# EAGLE design Bonus (EAGLE 9.2.2)

## Sheet 1 of 2
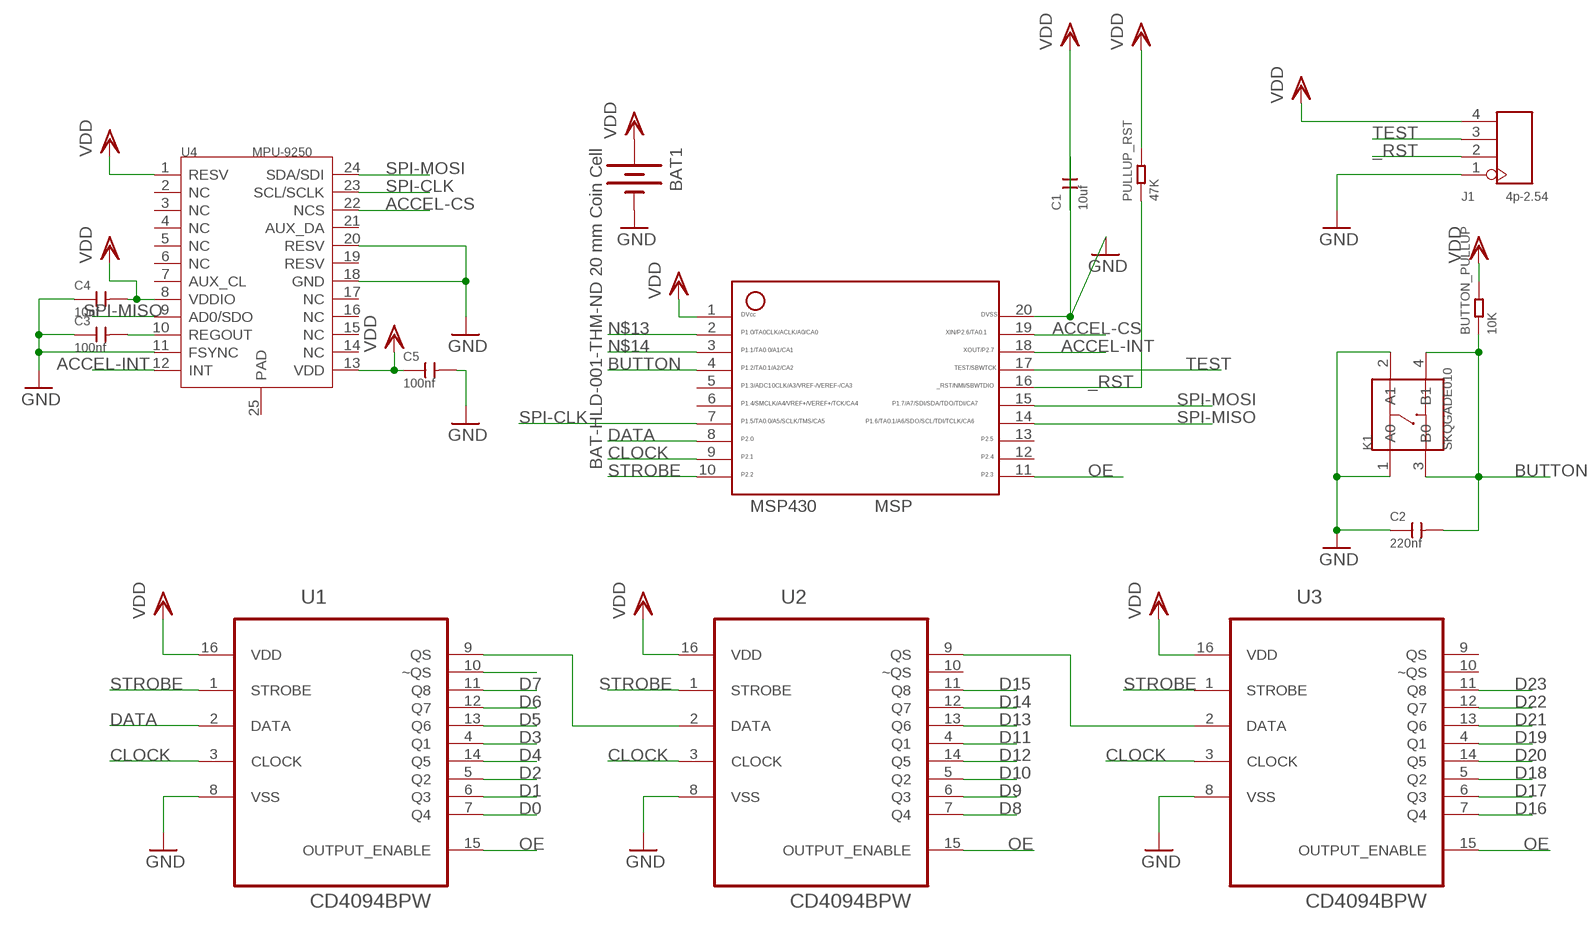
[diagram p0: schematic, sheet 1]

### Parts
BAT1  BAT-HLD-001-THM-ND 20 mm Coin Cell  BATTERYFOB  [BATTCON_20MM_PTH_COMPACT]
BUTTON_PULLUP  10K  SMD-RES-10K-1%-1/10W(0603)  [R0603]
C1  10uf  CERAMIC-10UF-10V-(-20%～+80%)-Y5V(0805)  [C0805]
C2  220nf  CERAMIC-220NF-25V-10%-X7R(0603)  [C0603]
C3  100nf  CERAMIC-100NF-25V-10%-X7R(0402)  [C0402]
C4  10nf  CERAMIC-10NF-50V-10%-X7R(0402)  [C0402]
C5  100nf  CERAMIC-100NF-25V-10%-X7R(0402)  [C0402]
J1  4p-2.54  DIP-BLACK-FEMALE-HEADER-VERT(4P-2.54)  [H4-2.54]
K1  SKQGADE010  SMD-BUTTON(4P-5.2X5.2X1.5MM-SKQGADE010)-SKQGADE010  [SW4-SMD-5.2X5.2X1.5MM]
MSP430  MSP  MSP430  [20_PIN]
PULLUP_RST  47K  SMD-RES-47K-5%-1/10W(0603)  [R0603]
U1  CD4094BPW  [SOP65P640X120-16N]
U2  CD4094BPW  [SOP65P640X120-16N]
U3  CD4094BPW  [SOP65P640X120-16N]
U4  MPU-9250  MOTION/POSITION-MPU-9250(QFN24)  [QFN24G-0.4-3X3MM]

### Nets
_RST: J1.2 MSP430.16 PULLUP_RST.1
ACCEL-CS: MSP430.19 U4.22(NCS)
ACCEL-INT: MSP430.18 U4.12(INT)
BUTTON: BUTTON_PULLUP.1 C2.2 K1.3(B0) K1.4(B1) MSP430.4
CLOCK: MSP430.9 U1.3(CLOCK) U2.3(CLOCK) U3.3(CLOCK)
D0: U1.7(Q4) ; also sheet 2
D1: U1.6(Q3) ; also sheet 2
D2: U1.5(Q2) ; also sheet 2
D3: U1.4(Q1) ; also sheet 2
D4: U1.14(Q5) ; also sheet 2
D5: U1.13(Q6) ; also sheet 2
D6: U1.12(Q7) ; also sheet 2
D7: U1.11(Q8) ; also sheet 2
D8: U2.7(Q4) ; also sheet 2
D9: U2.6(Q3) ; also sheet 2
D10: U2.5(Q2) ; also sheet 2
D11: U2.4(Q1) ; also sheet 2
D12: U2.14(Q5) ; also sheet 2
D13: U2.13(Q6) ; also sheet 2
D14: U2.12(Q7) ; also sheet 2
D15: U2.11(Q8) ; also sheet 2
D16: U3.7(Q4) ; also sheet 2
D17: U3.6(Q3) ; also sheet 2
D18: U3.5(Q2) ; also sheet 2
D19: U3.4(Q1) ; also sheet 2
D20: U3.14(Q5) ; also sheet 2
D21: U3.13(Q6) ; also sheet 2
D22: U3.12(Q7) ; also sheet 2
D23: U3.11(Q8) ; also sheet 2
DATA: MSP430.8 U1.2(DATA)
GND: BAT1.2(-) C1.2 C2.1 C3.1 C4.1 C5.2 J1.1 K1.1(A0) K1.2(A1) MSP430.20 U1.8(VSS) U2.8(VSS) U3.8(VSS) U4.11(FSYNC) U4.18(GND) U4.20(RESV) ; also sheet 2
N$7: U2.9(QS) U3.2(DATA)
N$8: U1.9(QS) U2.2(DATA)
N$11: U1.10(~QS)
N$12: C3.2 U4.10(REGOUT)
N$13: MSP430.2
N$14: MSP430.3
OE: MSP430.11 U1.15(OUTPUT_ENABLE) U2.15(OUTPUT_ENABLE) U3.15(OUTPUT_ENABLE)
SPI-CLK: MSP430.7 U4.23(SCL/SCLK)
SPI-MISO: MSP430.14 U4.9(AD0/SDO)
SPI-MOSI: MSP430.15 U4.24(SDA/SDI)
STROBE: MSP430.10 U1.1(STROBE) U2.1(STROBE) U3.1(STROBE)
TEST: J1.3 MSP430.17
VDD: BAT1.1(+) BAT1.3(+) BAT1.4(+) BAT1.5(+) BUTTON_PULLUP.2 C1.1 C4.2 C5.1 J1.4 MSP430.1 PULLUP_RST.2 U1.16(VDD) U2.16(VDD) U3.16(VDD) U4.1(RESV) U4.8(VDDIO) U4.13(VDD)
Unconnected: MSP430.5 MSP430.6 MSP430.12 MSP430.13 U2.10(~QS) U3.9(QS) U3.10(~QS) U4.2(NC) U4.3(NC) U4.4(NC) U4.5(NC) U4.6(NC) U4.7(AUX_CL) U4.14(NC) U4.15(NC) U4.16(NC) U4.17(NC) U4.19(RESV) U4.21(AUX_DA) U4.25(PAD)

## Sheet 2 of 2
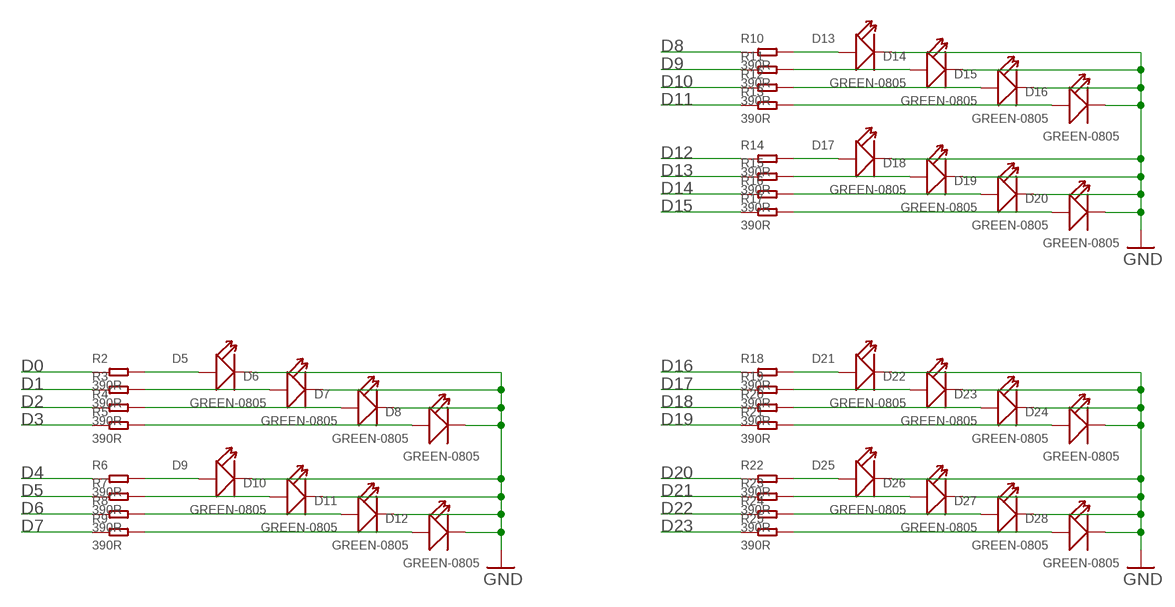
[diagram p1: schematic, sheet 2]

### Parts
D5  GREEN-0805  SMD-LED-CLEAR-GREEN(0805)  [LED-0805]
D6  GREEN-0805  SMD-LED-CLEAR-GREEN(0805)  [LED-0805]
D7  GREEN-0805  SMD-LED-CLEAR-GREEN(0805)  [LED-0805]
D8  GREEN-0805  SMD-LED-CLEAR-GREEN(0805)  [LED-0805]
D9  GREEN-0805  SMD-LED-CLEAR-GREEN(0805)  [LED-0805]
D10  GREEN-0805  SMD-LED-CLEAR-GREEN(0805)  [LED-0805]
D11  GREEN-0805  SMD-LED-CLEAR-GREEN(0805)  [LED-0805]
D12  GREEN-0805  SMD-LED-CLEAR-GREEN(0805)  [LED-0805]
D13  GREEN-0805  SMD-LED-CLEAR-GREEN(0805)  [LED-0805]
D14  GREEN-0805  SMD-LED-CLEAR-GREEN(0805)  [LED-0805]
D15  GREEN-0805  SMD-LED-CLEAR-GREEN(0805)  [LED-0805]
D16  GREEN-0805  SMD-LED-CLEAR-GREEN(0805)  [LED-0805]
D17  GREEN-0805  SMD-LED-CLEAR-GREEN(0805)  [LED-0805]
D18  GREEN-0805  SMD-LED-CLEAR-GREEN(0805)  [LED-0805]
D19  GREEN-0805  SMD-LED-CLEAR-GREEN(0805)  [LED-0805]
D20  GREEN-0805  SMD-LED-CLEAR-GREEN(0805)  [LED-0805]
D21  GREEN-0805  SMD-LED-CLEAR-GREEN(0805)  [LED-0805]
D22  GREEN-0805  SMD-LED-CLEAR-GREEN(0805)  [LED-0805]
D23  GREEN-0805  SMD-LED-CLEAR-GREEN(0805)  [LED-0805]
D24  GREEN-0805  SMD-LED-CLEAR-GREEN(0805)  [LED-0805]
D25  GREEN-0805  SMD-LED-CLEAR-GREEN(0805)  [LED-0805]
D26  GREEN-0805  SMD-LED-CLEAR-GREEN(0805)  [LED-0805]
D27  GREEN-0805  SMD-LED-CLEAR-GREEN(0805)  [LED-0805]
D28  GREEN-0805  SMD-LED-CLEAR-GREEN(0805)  [LED-0805]
R2  390R  SMD-RES-390R-5%-1/10W(0603)  [R0603]
R3  390R  SMD-RES-390R-5%-1/10W(0603)  [R0603]
R4  390R  SMD-RES-390R-5%-1/10W(0603)  [R0603]
R5  390R  SMD-RES-390R-5%-1/10W(0603)  [R0603]
R6  390R  SMD-RES-390R-5%-1/10W(0603)  [R0603]
R7  390R  SMD-RES-390R-5%-1/10W(0603)  [R0603]
R8  390R  SMD-RES-390R-5%-1/10W(0603)  [R0603]
R9  390R  SMD-RES-390R-5%-1/10W(0603)  [R0603]
R10  390R  SMD-RES-390R-5%-1/10W(0603)  [R0603]
R11  390R  SMD-RES-390R-5%-1/10W(0603)  [R0603]
R12  390R  SMD-RES-390R-5%-1/10W(0603)  [R0603]
R13  390R  SMD-RES-390R-5%-1/10W(0603)  [R0603]
R14  390R  SMD-RES-390R-5%-1/10W(0603)  [R0603]
R15  390R  SMD-RES-390R-5%-1/10W(0603)  [R0603]
R16  390R  SMD-RES-390R-5%-1/10W(0603)  [R0603]
R17  390R  SMD-RES-390R-5%-1/10W(0603)  [R0603]
R18  390R  SMD-RES-390R-5%-1/10W(0603)  [R0603]
R19  390R  SMD-RES-390R-5%-1/10W(0603)  [R0603]
R20  390R  SMD-RES-390R-5%-1/10W(0603)  [R0603]
R21  390R  SMD-RES-390R-5%-1/10W(0603)  [R0603]
R22  390R  SMD-RES-390R-5%-1/10W(0603)  [R0603]
R23  390R  SMD-RES-390R-5%-1/10W(0603)  [R0603]
R24  390R  SMD-RES-390R-5%-1/10W(0603)  [R0603]
R25  390R  SMD-RES-390R-5%-1/10W(0603)  [R0603]

### Nets
D0: R2.1 ; also sheet 1
D1: R3.1 ; also sheet 1
D2: R4.1 ; also sheet 1
D3: R5.1 ; also sheet 1
D4: R6.1 ; also sheet 1
D5: R7.1 ; also sheet 1
D6: R8.1 ; also sheet 1
D7: R9.1 ; also sheet 1
D8: R10.1 ; also sheet 1
D9: R11.1 ; also sheet 1
D10: R12.1 ; also sheet 1
D11: R13.1 ; also sheet 1
D12: R14.1 ; also sheet 1
D13: R15.1 ; also sheet 1
D14: R16.1 ; also sheet 1
D15: R17.1 ; also sheet 1
D16: R18.1 ; also sheet 1
D17: R19.1 ; also sheet 1
D18: R20.1 ; also sheet 1
D19: R21.1 ; also sheet 1
D20: R22.1 ; also sheet 1
D21: R23.1 ; also sheet 1
D22: R24.1 ; also sheet 1
D23: R25.1 ; also sheet 1
GND: D5.- D6.- D7.- D8.- D9.- D10.- D11.- D12.- D13.- D14.- D15.- D16.- D17.- D18.- D19.- D20.- D21.- D22.- D23.- D24.- D25.- D26.- D27.- D28.- ; also sheet 1
N$1: D5.+ R2.2
N$2: D6.+ R3.2
N$3: D7.+ R4.2
N$4: D8.+ R5.2
N$5: D9.+ R6.2
N$6: D10.+ R7.2
N$9: D11.+ R8.2
N$10: D12.+ R9.2
N$19: D13.+ R10.2
N$20: D14.+ R11.2
N$21: D15.+ R12.2
N$22: D16.+ R13.2
N$23: D17.+ R14.2
N$24: D18.+ R15.2
N$25: D19.+ R16.2
N$26: D20.+ R17.2
N$27: D21.+ R18.2
N$28: D22.+ R19.2
N$29: D23.+ R20.2
N$30: D24.+ R21.2
N$31: D25.+ R22.2
N$32: D26.+ R23.2
N$33: D27.+ R24.2
N$34: D28.+ R25.2

## Library data of the parts
BAT1 = Battery:BATTERY: Compact CR2032 Battery Holder SMT ground pad 20MM_4LEGS, Digikey: BAT-HLD-001-THM-OTL
BUTTON_PULLUP = Seeed-OPL-Resistor:SMD-RES-10K-1%-1/10W(0603): 301010299; MPN: RC0603FR-0710KL
C1 = Seeed-OPL-Capacitor:CERAMIC-10UF-10V-(-20%～+80%)-Y5V(0805): 302010158; MPN: CC0805ZKY5V6BB106
C2 = OPL_Capacitor:CERAMIC-220NF-25V-10%-X7R(0603): 302010073; MPN: CC0603KRX7R8BB224
C3 C5 = Seeed-OPL-Capacitor:CERAMIC-100NF-25V-10%-X7R(0402): 302010024; MPN: CC0402KRX7R8BB104
C4 = Seeed-OPL-Capacitor:CERAMIC-10NF-50V-10%-X7R(0402): 302010006; MPN: CC0402KRX7R9BB103
D5-D28 = Seeed-OPL-Diode:SMD-LED-CLEAR-GREEN(0805): 304090057; MPN: 17-215SYGC/S530-E2/TR8
J1 = OPL_Connector:DIP-BLACK-FEMALE-HEADER-VERT(4P-2.54): 320030017; MPN: F185-1104A1BSYA1
K1 = OPL_Switch:SMD-BUTTON(4P-5.2X5.2X1.5MM-SKQGADE010): 311020017; MPN: SKQGADE010
MSP430 = RatDBS:MSP430: MSP430 20 pins
PULLUP_RST = Seeed-OPL-Resistor:SMD-RES-47K-5%-1/10W(0603): 301010084; MPN: RC0603JR-0747KL
R2-R25 = OPL_Resistor:SMD-RES-390R-5%-1/10W(0603): 301010297; MPN: RC0603JR-07390RL
U1-U3 = Texas Instruments_By_element14_Batch_1:CD4094BPW: CMOS 8 stage shift and store bus register; MPN: CD4094BPW; OC_FARNELL: 1595402; OC_NEWARK: 08N6269; PACKAGE: TSSOP-16; SUPPLIER: Texas Instruments
U4 = Seeed-OPL-sensor:MOTION/POSITION-MPU-9250(QFN24): 314990005; MPN: MPU-9250

## Board
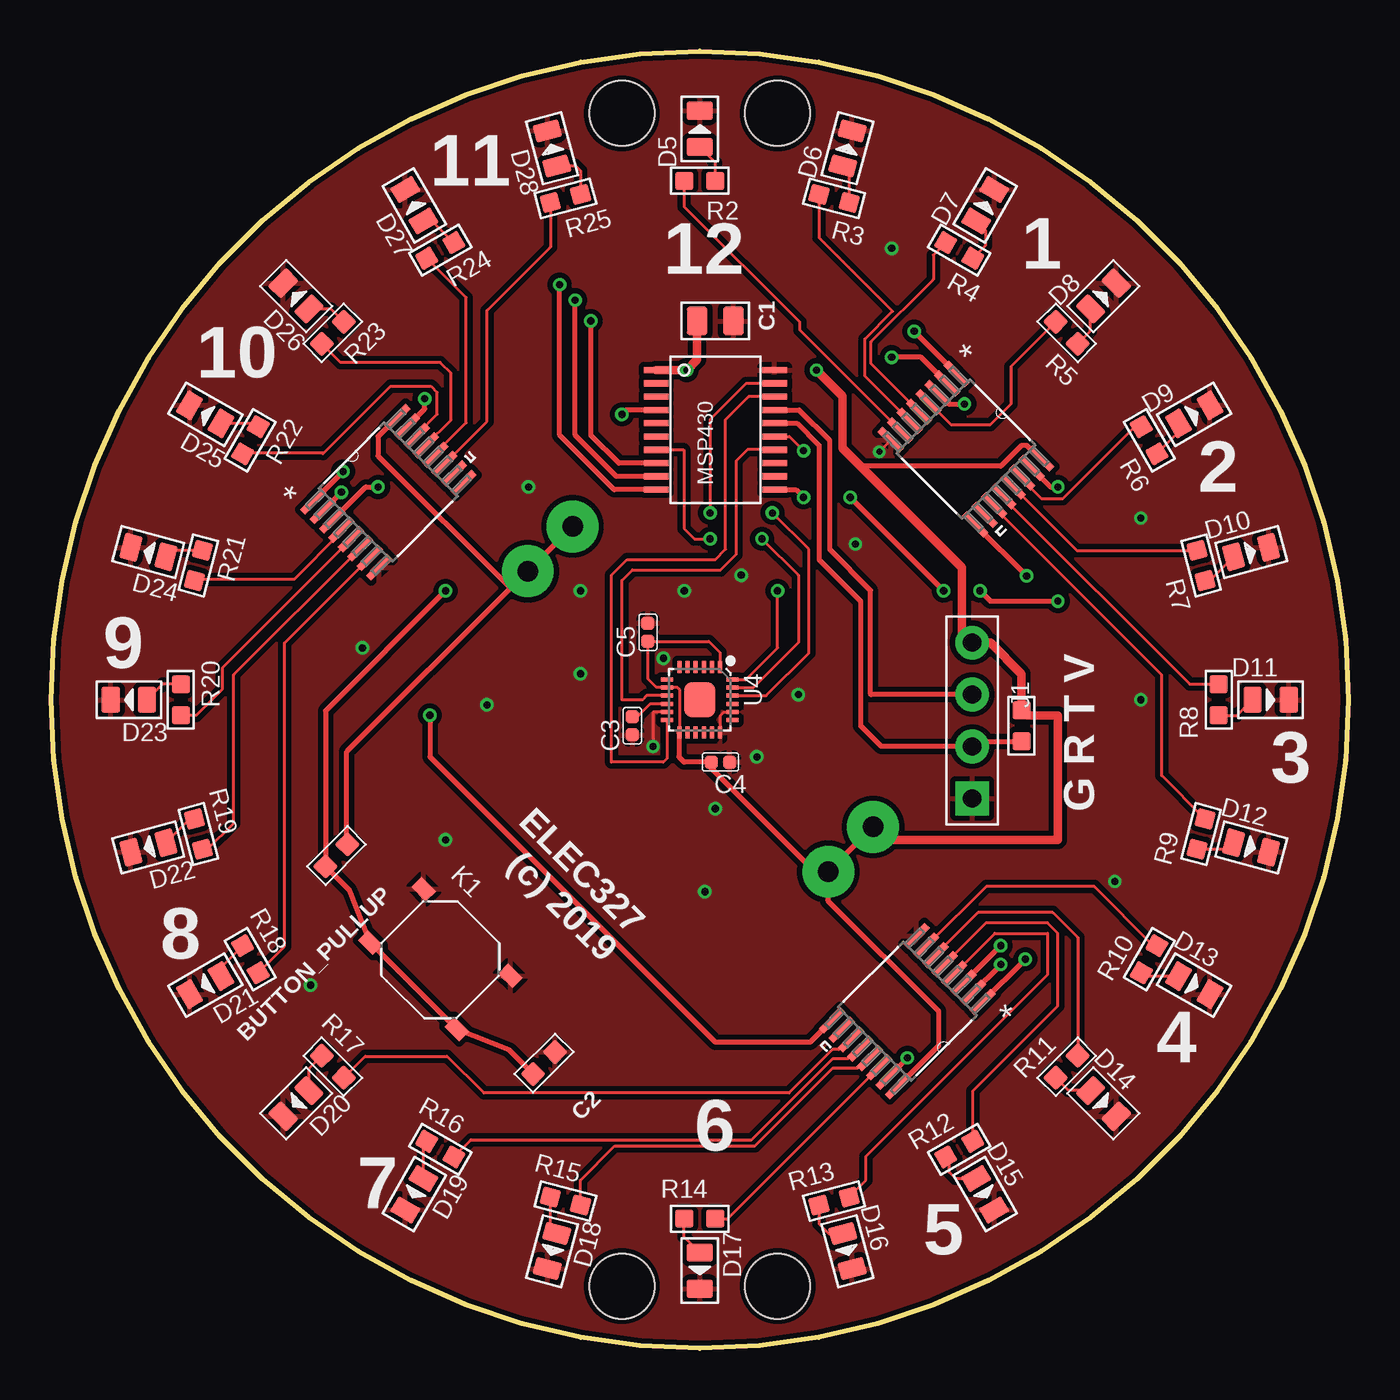
[diagram p2: board, top side]
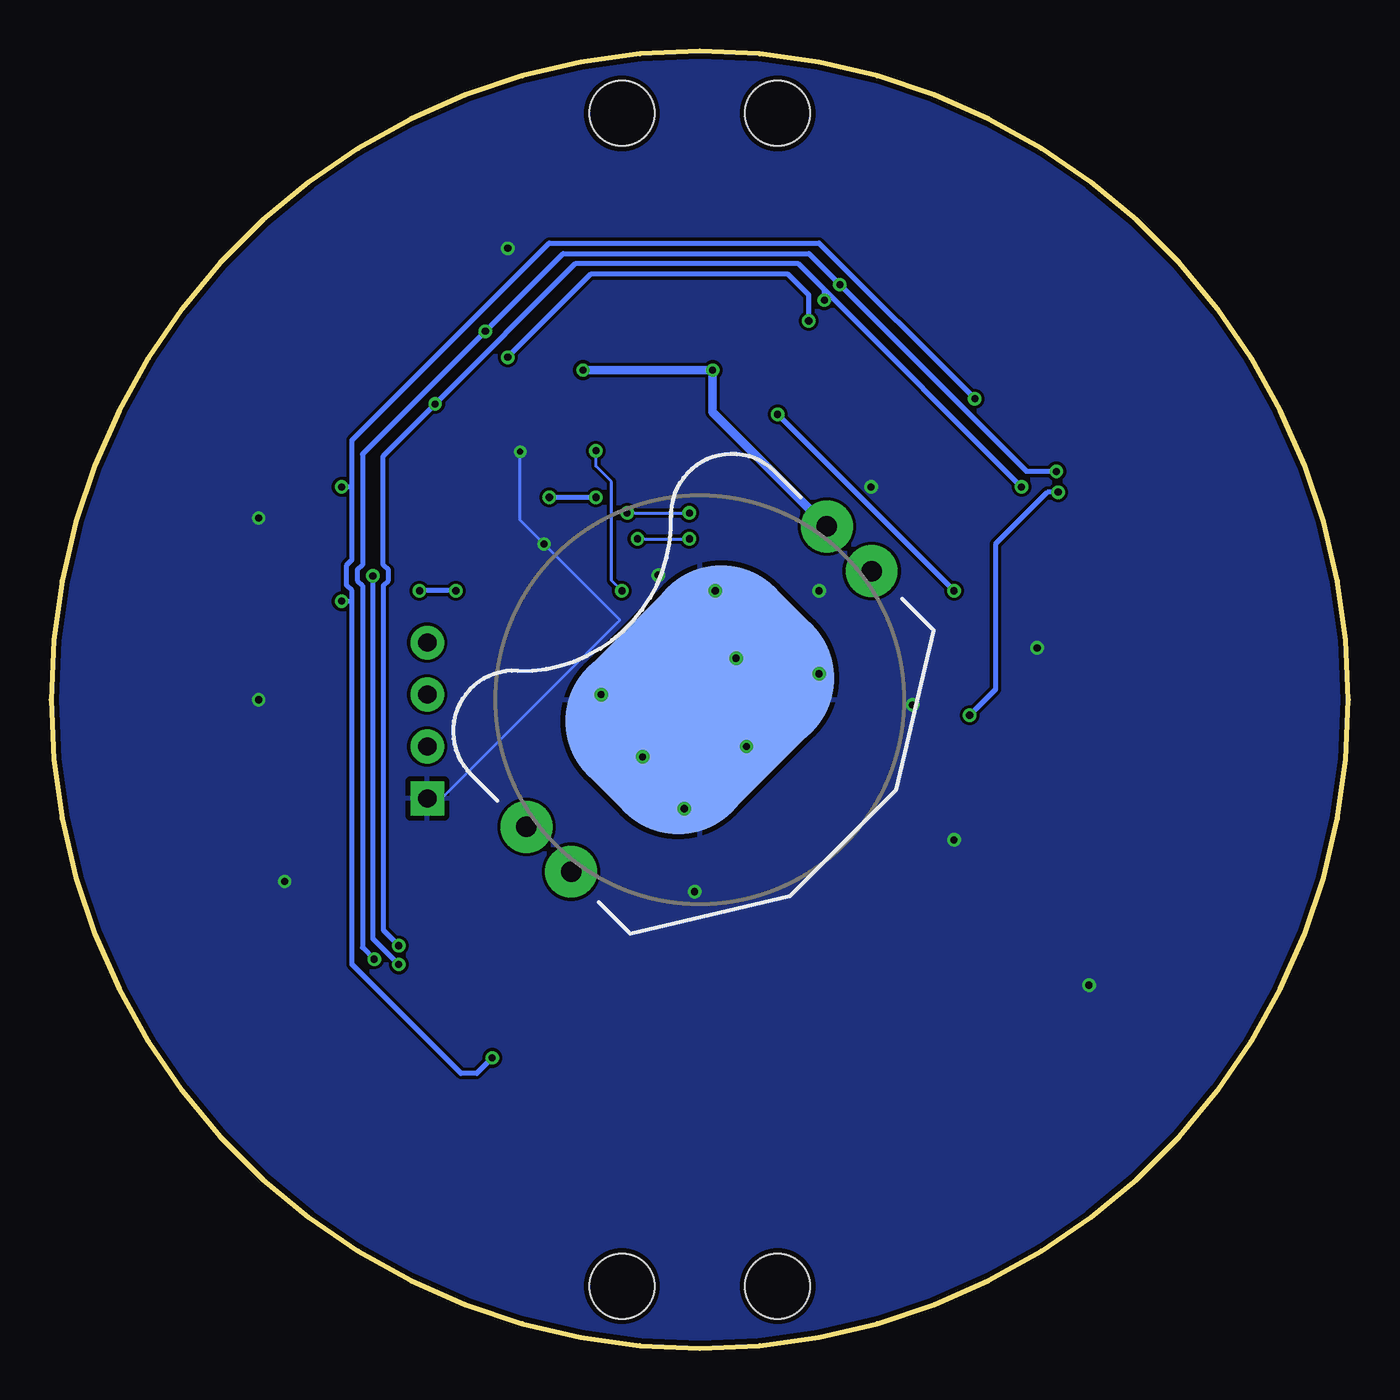
[diagram p3: board, bottom side, seen from below]

Size 63.5 x 63.5 mm. Coordinates in mm from the lower left corner, seen from the top.
Outline: 31.75,63.5 arc-90 63.5,31.75 arc-90 31.75,0 arc-90 0,31.75 arc-90 31.75,63.5
Copper layers (1*16): Top 0.035mm / dielectric 1.5mm / Bottom 0.035mm
Design rules "Seeed_DRU": minimum track width 6mil, minimum drill 12mil, track to track 6mil, track to pad 6mil, pad to pad 6mil, via to via 6mil, smd to smd 0mil, copper to edge 10mil, drill to drill 10mil, minimum pad ring 10mil, minimum via ring 6mil, stop-mask expansion 2mil, vias tented up to drill 100mil, thermal gap 10mil
Holes 3.17 mm at 27.94,60.45 35.56,60.45 35.56,3.05 27.94,3.05

### Footprints (pad centres in the part's own frame; a part is rotated, then mirrored left to right if it is on the bottom)
BATTCON_20MM_PTH_COMPACT = drill 1 pad 2.54: 1 -10.4,1.6; 3 10.4,1.6; 4 10.4,-1.5; 5 -10.4,-1.5 | smd 13 x 10: 2 0,0
R0603 = smd 0.889 x 0.889: 1 0,0.762; 2 0,-0.762
C0805 = smd 1.397 x 1.016: 1 0,0.889; 2 0,-0.889
C0603 = smd 0.889 x 0.889: 1 0,0.762; 2 0,-0.762
C0402 = smd 0.635 x 0.635: 1 0,0.445; 2 0,-0.445
LED-0805 = smd 0.889 x 1.27: + -0.889,0; - 0.889,0
H4-2.54 = drill 0.889 pad 1.651 square: 1 0,3.81 | drill 0.889 pad 1.651: 2 0,1.27; 3 0,-1.27; 4 0,-3.81
SW4-SMD-5.2X5.2X1.5MM = smd 1 x 0.7: 1 -3,1.85; 2 3,1.85; 3 -3,-1.85; 4 3,-1.85
20_PIN = smd 0.3 x 1.2: 1 -2.925,-2.9; 2 -2.275,-2.9; 3 -1.625,-2.9; 4 -0.975,-2.9; 5 -0.325,-2.9; 6 0.325,-2.9; 7 0.975,-2.9; 8 1.625,-2.9; 9 2.275,-2.9; 10 2.925,-2.9; 11 2.925,2.9; 12 2.275,2.9; 13 1.625,2.9; 14 0.975,2.9; 15 0.325,2.9; 16 -0.325,2.9; 17 -0.975,2.9; 18 -1.625,2.9; 19 -2.275,2.9; 20 -2.925,2.9
SOP65P640X120-16N = smd 1.473 x 0.356: 1 -2.921,2.286; 2 -2.921,1.626; 3 -2.921,0.965; 4 -2.921,0.33; 5 -2.921,-0.33; 6 -2.921,-0.965; 7 -2.921,-1.626; 8 -2.921,-2.286; 9 2.921,-2.286; 10 2.921,-1.626; 11 2.921,-0.965; 12 2.921,-0.33; 13 2.921,0.33; 14 2.921,0.965; 15 2.921,1.626; 16 2.921,2.286
QFN24G-0.4-3X3MM = smd 0.6 x 0.2: 1 -1.6,1; 2 -1.6,0.6; 3 -1.6,0.2; 4 -1.6,-0.2; 5 -1.6,-0.6; 6 -1.6,-1; 13 1.6,-1; 14 1.6,-0.6; 15 1.6,-0.2; 16 1.6,0.2; 17 1.6,0.6; 18 1.6,1 | smd 0.2 x 0.6: 7 -1,-1.6; 8 -0.6,-1.6; 9 -0.2,-1.6; 10 0.2,-1.6; 11 0.6,-1.6; 12 1,-1.6; 19 1,1.6; 20 0.6,1.6; 21 0.2,1.6; 22 -0.2,1.6; 23 -0.6,1.6; 24 -1,1.6 | smd 1.7 x 1.54: 25 0,0

### Placement (x,y rotation side)
BAT1  31.75,31.75 45 bottom
BUTTON_PULLUP  13.97,24.13 135 top
C1  32.51,50.29 90 top
C2  24.13,13.97 315 top
C3  28.45,30.48 180 top
C4  32.77,28.7 270 top
C5  29.21,35.05 180 top
D5  31.75,59.69 90 top
D6  38.98,58.74 75 top
D7  45.72,55.95 60 top
D8  51.51,51.51 45 top
D9  55.95,45.72 30 top
D10  58.74,38.98 15 top
D11  59.69,31.75 0 top
D12  58.74,24.52 345 top
D13  55.95,17.78 330 top
D14  51.51,11.99 315 top
D15  45.72,7.55 300 top
D16  38.98,4.76 285 top
D17  31.75,3.81 270 top
D18  24.52,4.76 255 top
D19  17.78,7.55 240 top
D20  11.99,11.99 225 top
D21  7.55,17.78 210 top
D22  4.76,24.52 195 top
D23  3.81,31.75 180 top
D24  4.76,38.98 165 top
D25  7.55,45.72 150 top
D26  11.99,51.51 135 top
D27  17.78,55.95 120 top
D28  24.52,58.74 105 top
J1  45.09,30.73 180 top
K1  19.05,19.05 315 top
MSP430  32.51,44.96 270 top
PULLUP_RST  47.5,30.48 180 top
R2  31.75,57.15 90 top
R3  38.32,56.28 75 top
R4  44.45,53.75 60 top
R5  49.71,49.71 45 top
R6  53.75,44.45 30 top
R7  56.28,38.32 15 top
R8  57.15,31.75 0 top
R9  56.28,25.18 345 top
R10  53.75,19.05 330 top
R11  49.71,13.79 315 top
R12  44.45,9.75 300 top
R13  38.32,7.22 285 top
R14  31.75,6.35 270 top
R15  25.18,7.22 255 top
R16  19.05,9.75 240 top
R17  13.79,13.79 225 top
R18  9.75,19.05 210 top
R19  7.22,25.18 195 top
R20  6.35,31.75 180 top
R21  7.22,38.32 165 top
R22  9.75,44.45 150 top
R23  13.79,49.71 135 top
R24  19.05,53.75 120 top
R25  25.18,56.28 105 top
U1  44.78,44.02 315 top
U2  41.91,16.51 225 top
U3  16.51,41.91 45 top
U4  31.75,31.75 270 top

### Tracks (layer width: path | path; a pad name or v marks a point on that pad's centre or on a via)
_RST
  Top 0.254: MSP430.16 36.51,45.28 37.59,44.2 37.59,38.61 39.62,36.58 39.62,30.48 40.64,29.46 J1.2 45.34,29.72 PULLUP_RST.1
ACCEL-CS  (via drill 0.35)
  Top 0.152: U4.22 35,31.95 37.08,34.04 37.08,39.12 v35.31,40.89 | MSP430.19 34.02,47.23 32.26,45.47 v32.26,40.89
  Bottom 0.152: v35.31,40.89 v32.26,40.89
ACCEL-INT
  Top 0.152: U4.12 30.15,28.88 29.97,28.7 27.43,28.7 27.43,37.85 28.19,38.61 32.51,38.61 33.02,39.12 33.02,45.47 34.14,46.58 MSP430.18
BUTTON  (via drill 0.35)
  Top 0.254: MSP430.4 28.15,45.93 v27.94,45.72 | v19.3,37.08 13.43,31.21 BUTTON_PULLUP.1 14.6,22.42 K1.3 K1.4 22.42,14.6 C2.2
  Bottom 0.254: v27.94,45.72 v19.3,37.08
CLOCK  (via drill 0.35)
  Top 0.254: U1.3 43.93,46.23 v44.7,46.23 | U3.3 15.4,42.16 v16,42.16 | U2.3 v46.48,19.72 | MSP430.9 27.68,42.68 25.65,44.7 v25.65,51.31
  Bottom 0.254: v46.48,19.72 47.24,20.48 47.24,37.34 46.99,37.59 46.99,38.1 47.24,38.35 47.24,43.69 v44.7,46.23 37.85,53.09 26.92,53.09 25.65,51.82 | 25.65,51.82 v16,42.16 | v25.65,51.31 25.65,51.82
D0
  Top 0.152: U1.7 36.64,49.85 36.64,50.22 30.99,55.88 R2.1
D1
  Top 0.152: U1.6 39.83,47.6 39.83,49.4 41.19,50.76 37.59,54.36 R3.1
D2
  Top 0.152: U1.5 40.13,48.2 40.13,49.28 43.18,52.32 43.18,53.52 R4.1
D3
  Top 0.152: U1.4 44.05,45.21 45.97,45.21 46.99,46.23 46.99,48.07 R5.1
D4
  Top 0.152: U1.14 47.55,42.52 48.46,41.6 49.53,41.6 53.03,45.11 R6.1
D5
  Top 0.152: U1.13 50.2,39.06 R7.1
D6
  Top 0.152: U1.12 46.63,41.6 55.73,32.51 R8.1
D7
  Top 0.152: U1.11 46.18,41.15 54.36,32.97 54.36,28.04 R9.1
D8
  Top 0.152: U2.7 42.98,19.81 45.77,22.61 51.05,22.61 53.95,19.71 R10.1
D9
  Top 0.152: U2.6 45.37,21.34 49.02,21.34 50.25,20.11 R11.1
D10
  Top 0.152: U2.5 45.76,20.83 48.77,20.83 49.28,20.32 49.28,16.76 45.11,12.6 R12.1
D11
  Top 0.152: U2.4 46.19,20.32 48.77,20.32 48.77,18.29 39.88,9.4 39.88,8.23 R13.1
D12
  Top 0.152: U2.14 33.12,6.35 R14.1
D13
  Top 0.152: U2.13 39.93,14.17 39.47,13.72 38.25,13.72 34.44,9.91 27.58,9.91 25.91,8.23 R15.1
D14
  Top 0.152: U2.12 39.47,14.63 39.01,14.17 38.25,14.17 34.29,10.21 20.55,10.21 R16.1
D15
  Top 0.152: U2.11 39.01,15.09 38.56,14.63 38.25,14.63 36.12,12.5 21.18,12.5 19.38,14.3 15.38,14.3 R17.1
D16
  Top 0.152: U3.7 11.43,34.53 11.43,19.69 R18.1
D17
  Top 0.152: U3.6 8.94,32.98 8.94,25.7 7.68,24.44 R19.1
D18
  Top 0.152: R20.1 7.11,30.99 8.38,32.26 8.38,33.31 U3.5
D19
  Top 0.152: U3.4 14.17,39.93 11.89,37.64 7.37,37.64 | 7.37,37.64 7.07,37.64 | R21.1 7.31,37.59 7.37,37.64
D20
  Top 0.152: U3.14 17.98,44.81 18.9,45.72 18.9,46.79 18.59,47.09 16.61,47.09 13.34,43.81 | 13.34,43.81 13.31,43.79 | 13.34,43.81 9.4,43.81 R22.1
D21
  Top 0.152: U3.13 19.56,45.42 19.56,47.75 19.05,48.26 14.16,48.26 R23.1
D22
  Top 0.152: U3.12 18.9,43.89 20.32,45.31 20.32,51.44 R24.1
D23
  Top 0.152: U3.11 21.34,45.37 21.34,50.8 24.44,53.9 R25.1
DATA  (via drill 0.35)
  Top 0.254: MSP430.8 27.79,43.33 26.42,44.7 v26.42,50.29 | U1.2 42.58,48.51 v41.15,48.51
  Bottom 0.254: v26.42,50.29 26.42,51.56 27.43,52.58 37.08,52.58 v41.15,48.51
GND  (via drill 0.3, 0.35)
  Top 0.152: v40.54,43.89 41,44.35 U1.8 | 16.15,38.25 U3.8 | 42.67,20.27 42.37,20.27 U2.8 | U4.18 32.77,30.17 32.77,30.99 32.93,31.15 U4.20 | U4.11 29.46,31.15 v29.46,29.46
  Bottom 0.152: v40.54,43.89 40.54,40.54 35.66,35.66 44.35,26.98
  other vias: 25.91,33.02 25.91,37.08 36.58,32 32.51,26.42 39.37,39.37 23.37,42.16 15.24,34.29 52.07,22.86 53.34,31.75 53.34,40.64 41.15,53.85 12.7,17.78 34.54,28.96 30.99,37.08 21.34,31.5 32,22.35 29.97,33.78 19.3,24.89 33.78,37.85
  pour Top (isolate 0.254): 0,0 63.5,0 63.5,63.5 0,63.5
  pour Bottom: 0,0 0,63.5 63.5,63.5 63.5,0
N$1
  Top 0.152: D5.+ 32.51,58.04 R2.2
N$2
  Top 0.152: D6.+ 39.06,57.57 R3.2
N$3
  Top 0.152: 45.11,55.01 D7.+ 45.72,54.73 45.72,53.98 R4.2
N$4
  Top 0.152: D8.+ 50.88,49.8 R5.2
N$5
  Top 0.152: D9.+ 55.18,44.84 R6.2
N$6
  Top 0.152: D10.+ 56.72,37.59 R7.2
N$7  (via drill 0.35)
  Top 0.254: U3.2 v14.21,41.91 | v18.54,30.99 18.54,28.96 32.51,14.99 37.15,14.99 U2.9
  Bottom 0.254: v14.21,41.91 14.73,41.91 17.27,39.37 17.27,32.26 v18.54,30.99
N$8  (via drill 0.35)
  Top 0.254: U1.9 v47.75,37.81 | U2.2 46.48,18.78 v46.48,18.8
  Bottom 0.254: v47.75,37.81 47.75,20.07 v46.48,18.8
N$9
  Top 0.152: D11.+ 58.04,30.99 R8.2
N$10
  Top 0.152: D12.+ 57.84,24.71 57.57,24.44 R9.2
N$12
  Top 0.152: C3.2 28.7,30.92 29.33,31.55 U4.10
N$19
  Top 0.152: D13.+ 53.53,18.22 R10.2
N$20
  Top 0.152: D14.+ 49.8,12.62 R11.2
N$21
  Top 0.152: 44.84,8.32 D15.+ 44.26,8.32 43.94,8.64 43.94,9.22 R12.2
N$22
  Top 0.152: 38.75,5.86 D16.+ 38.07,5.62 37.59,6.1 R13.2
N$23
  Top 0.152: D17.+ 30.99,5.46 R14.2
N$24
  Top 0.152: D18.+ 24.44,5.93 R15.2
N$25
  Top 0.152: D19.+ 18.22,9.97 R16.2
N$26
  Top 0.152: D20.+ 12.62,13.7 R17.2
N$27
  Top 0.152: D21.+ 8.32,18.66 R18.2
N$28
  Top 0.152: D22.+ 6.78,25.91 R19.2
N$29
  Top 0.152: D23.+ 5.46,32.51 R20.2
N$30
  Top 0.152: D24.+ 5.79,38.92 5.93,39.06 R21.2
N$31
  Top 0.152: D25.+ 9.97,45.28 R22.2
N$32
  Top 0.152: D26.+ 13.7,50.88 R23.2
N$33
  Top 0.152: D27.+ 18.29,55.18 18.66,55.18 R24.2
N$34
  Top 0.152: D28.+ 25.62,57.88 25.65,57.91 25.91,57.65 R25.2
OE  (via drill 0.35)
  Top 0.254: U3.15 18.29,45.99 v18.29,46.48 | U2.15 v41.91,14.22 | U1.15 48.93,42.16 v49.28,42.16 | v45.47,37.08 45.97,36.58 v49.28,36.58 | MSP430.11 36.45,42.03 v36.83,41.66 | v39.12,41.66 v43.69,37.08
  Bottom 0.254: 48.77,36.58 48.77,18.8 43.43,13.46 42.67,13.46 v41.91,14.22 | 48.77,36.58 48.77,37.08 49.02,37.34 49.02,38.35 48.77,38.61 48.77,42.16 | 48.77,42.16 48.77,44.45 39.12,54.1 25.91,54.1 v18.29,46.48 | 48.77,42.16 v49.28,42.16 | v43.69,37.08 v45.47,37.08 | v49.28,36.58 48.77,36.58 | v36.83,41.66 v39.12,41.66
SPI-CLK  (via drill 0.35)
  Top 0.152: U4.23 34.38,32.35 36.58,34.54 36.58,37.85 v34.8,39.62 | MSP430.7 30.95,43.98 30.99,43.94 30.99,40.13 31.5,39.62 v32.26,39.62
  Bottom 0.152: v34.8,39.62 v32.26,39.62
SPI-MISO
  Top 0.152: U4.9 29.16,31.95 28.96,31.75 27.94,31.75 27.94,37.59 28.45,38.1 32.77,38.1 33.53,38.86 33.53,43.43 34.08,43.98 MSP430.14
SPI-MOSI  (via drill 0.35)
  Top 0.152: U4.24 34.02,32.75 35.56,34.29 v35.56,37.08 | MSP430.15 36.14,44.63 v36.83,43.94
  Bottom 0.152: v36.83,43.94 36.83,43.18 36.07,42.42 36.07,37.59 v35.56,37.08
STROBE  (via drill 0.35)
  Top 0.254: U1.1 v42.24,49.78 | U3.1 v14.29,42.93 | U2.1 v47.68,19.05 | MSP430.10 27.56,42.03 24.89,44.7 v24.89,52.07
  Bottom 0.254: v14.29,42.93 15.75,42.93 v24.89,52.07 26.42,53.59 38.43,53.59 v42.24,49.78 48.26,43.77 48.26,38.35 48.51,38.1 48.51,37.59 48.26,37.34 48.26,19.63 v47.68,19.05
TEST
  Top 0.254: MSP430.17 36.62,45.93 38.1,44.45 38.1,39.12 40.11,37.11 40.11,32.03 40.13,32 J1.3
VDD  (via drill 0.35)
  Top 0.152: U4.13 30.75,32.24 30.64,32.35 U4.8 29.63,32.35 29.21,32.77 29.21,34.55 | C5.1 32.19,34.61 32.75,34.05 U4.1
  Top 0.254: U1.16 48.38,43.57 47.75,44.2 47.5,44.2 46.48,43.18 39.62,43.18 | U2.16 43.43,14.8 43.43,16.51 38.01,21.93 38.04,21.97 BAT1.5 | U3.16 16,44.63 16,43.69 22.48,37.21 | C5.1 29.21,34.55 | U4.13 30.73,30.13 30.73,28.96 30.99,28.7 C4.2 32.32,28.38 37.37,23.34 BAT1.5 | BUTTON_PULLUP.2 14.48,24.7 14.48,29.21 22.48,37.21 | BAT1.1 BAT1.5 | 22.48,37.21 23.31,38.04 BAT1.4 BAT1.3
  Top 0.406: MSP430.1 v31.12,47.88 31.62,48.39 C1.1 | v37.46,47.88 38.73,46.61 38.73,44.07 39.62,43.18 44.58,38.23 44.58,34.92 44.96,34.54 J1.4 45.97,34.54 47.5,33.02 PULLUP_RST.2 47.75,30.99 49.28,30.99 49.28,24.89 40.87,24.89 BAT1.1
  Bottom 0.406: v37.46,47.88 v31.12,47.88 31.12,45.83 BAT1.3

### Text on the board
tNames: 11 | 12 | 1 | 10 | 2 | 9 | 3 | G R T V | ELEC327 / (c) 2019 | 8 | 4 | 6 | 7 | 5
tDocu: V T R G